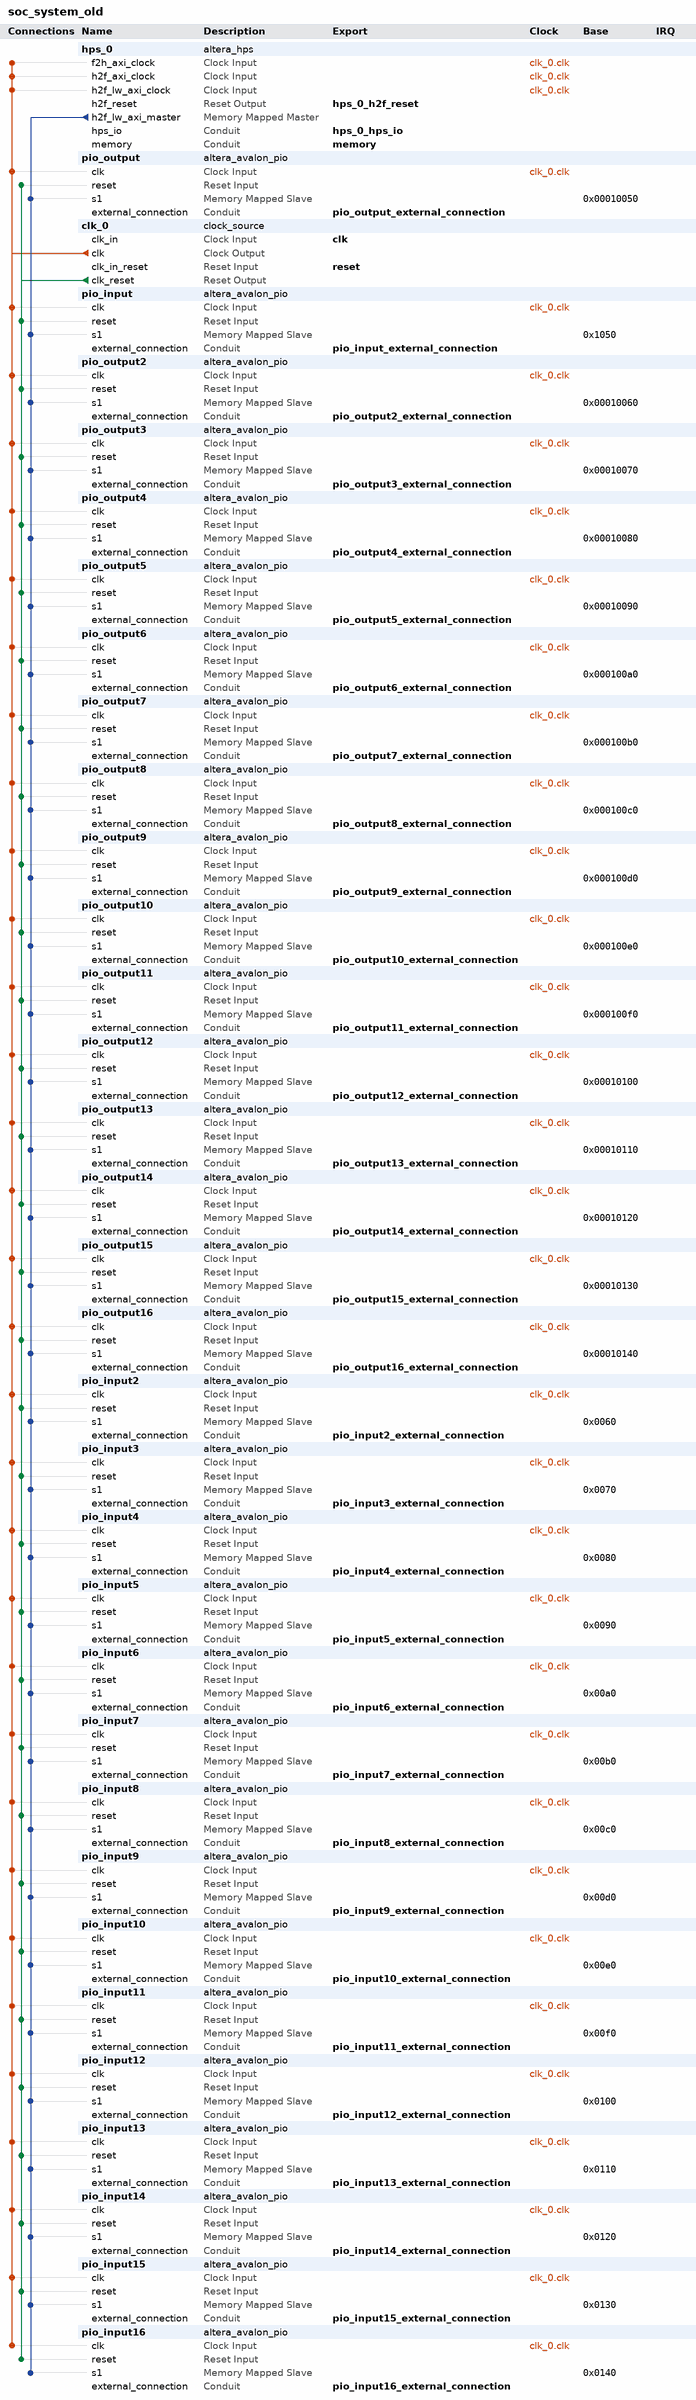
[diagram p0: system contents]
# Platform Designer (Qsys) system soc_system_old, Cyclone V 5CSEMA5F31C6
# Parameters at their usual value, and those the tool derives, are not listed.
package require -exact qsys 16.1
create_system soc_system_old
set_project_property DEVICE_FAMILY {Cyclone V}
set_project_property DEVICE 5CSEMA5F31C6

add_instance hps_0 altera_hps 16.1
set_instance_parameter_value hps_0 EMAC1_Mode RGMII
set_instance_parameter_value hps_0 EMAC1_PinMuxing {HPS I/O Set 0}
set_instance_parameter_value hps_0 F2SCLK_COLDRST_Enable false
set_instance_parameter_value hps_0 F2SCLK_DBGRST_Enable false
set_instance_parameter_value hps_0 F2SCLK_WARMRST_Enable false
set_instance_parameter_value hps_0 F2SINTERRUPT_Enable true
set_instance_parameter_value hps_0 F2S_Width 2
set_instance_parameter_value hps_0 FPGA_PERIPHERAL_OUTPUT_CLOCK_FREQ_EMAC0_GTX_CLK 100
set_instance_parameter_value hps_0 FPGA_PERIPHERAL_OUTPUT_CLOCK_FREQ_EMAC0_MD_CLK 100.0
set_instance_parameter_value hps_0 FPGA_PERIPHERAL_OUTPUT_CLOCK_FREQ_EMAC1_GTX_CLK 100
set_instance_parameter_value hps_0 FPGA_PERIPHERAL_OUTPUT_CLOCK_FREQ_EMAC1_MD_CLK 100.0
set_instance_parameter_value hps_0 HPS_PROTOCOL DDR3
set_instance_parameter_value hps_0 I2C0_Mode I2C
set_instance_parameter_value hps_0 I2C0_PinMuxing {HPS I/O Set 0}
set_instance_parameter_value hps_0 I2C1_Mode I2C
set_instance_parameter_value hps_0 I2C1_PinMuxing {HPS I/O Set 0}
set_instance_parameter_value hps_0 LWH2F_Enable true
set_instance_parameter_value hps_0 MEM_BANKADDR_WIDTH 3
set_instance_parameter_value hps_0 MEM_CLK_FREQ 400.0
set_instance_parameter_value hps_0 MEM_COL_ADDR_WIDTH 10
set_instance_parameter_value hps_0 MEM_DQ_WIDTH 32
set_instance_parameter_value hps_0 MEM_DRV_STR RZQ/7
set_instance_parameter_value hps_0 MEM_ROW_ADDR_WIDTH 15
set_instance_parameter_value hps_0 MEM_RTT_NOM RZQ/4
set_instance_parameter_value hps_0 MEM_RTT_WR RZQ/4
set_instance_parameter_value hps_0 MEM_TCL 11
set_instance_parameter_value hps_0 MEM_TFAW_NS 30.0
set_instance_parameter_value hps_0 MEM_TRAS_NS 35.0
set_instance_parameter_value hps_0 MEM_TRCD_NS 13.75
set_instance_parameter_value hps_0 MEM_TRFC_NS 260.0
set_instance_parameter_value hps_0 MEM_TRP_NS 13.75
set_instance_parameter_value hps_0 MEM_VENDOR JEDEC
set_instance_parameter_value hps_0 MEM_WTCL 8
set_instance_parameter_value hps_0 QSPI_Mode {1 SS}
set_instance_parameter_value hps_0 QSPI_PinMuxing {HPS I/O Set 0}
set_instance_parameter_value hps_0 REF_CLK_FREQ 25.0
set_instance_parameter_value hps_0 S2FCLK_USER2CLK 5
set_instance_parameter_value hps_0 S2F_Width 2
set_instance_parameter_value hps_0 SDIO_Mode {4-bit Data}
set_instance_parameter_value hps_0 SDIO_PinMuxing {HPS I/O Set 0}
set_instance_parameter_value hps_0 SPIM1_Mode {Single Slave Select}
set_instance_parameter_value hps_0 SPIM1_PinMuxing {HPS I/O Set 0}
set_instance_parameter_value hps_0 STM_Enable false
set_instance_parameter_value hps_0 TIMING_BOARD_AC_SKEW 0.03
set_instance_parameter_value hps_0 TIMING_BOARD_AC_TO_CK_SKEW 0.0
set_instance_parameter_value hps_0 TIMING_BOARD_DQ_TO_DQS_SKEW 0.0
set_instance_parameter_value hps_0 TIMING_BOARD_MAX_CK_DELAY 0.03
set_instance_parameter_value hps_0 TIMING_BOARD_MAX_DQS_DELAY 0.02
set_instance_parameter_value hps_0 TIMING_BOARD_SKEW_BETWEEN_DQS 0.08
set_instance_parameter_value hps_0 TIMING_BOARD_SKEW_CKDQS_DIMM_MAX 0.16
set_instance_parameter_value hps_0 TIMING_BOARD_SKEW_CKDQS_DIMM_MIN 0.09
set_instance_parameter_value hps_0 TIMING_BOARD_SKEW_WITHIN_DQS 0.01
set_instance_parameter_value hps_0 TIMING_TDH 65
set_instance_parameter_value hps_0 TIMING_TDQSCK 255
set_instance_parameter_value hps_0 TIMING_TDQSQ 125
set_instance_parameter_value hps_0 TIMING_TDS 30
set_instance_parameter_value hps_0 TIMING_TIH 140
set_instance_parameter_value hps_0 TIMING_TIS 180
set_instance_parameter_value hps_0 TIMING_TQSH 0.4
set_instance_parameter_value hps_0 UART0_Mode {No Flow Control}
set_instance_parameter_value hps_0 UART0_PinMuxing {HPS I/O Set 0}
set_instance_parameter_value hps_0 USB1_Mode SDR
set_instance_parameter_value hps_0 USB1_PinMuxing {HPS I/O Set 0}
set_instance_parameter_value hps_0 desired_cfg_clk_mhz 100.0
set_instance_parameter_value hps_0 desired_qspi_clk_mhz 400.0

add_instance pio_output altera_avalon_pio 16.1
set_instance_parameter_value pio_output direction Output
set_instance_parameter_value pio_output resetValue 1023
set_instance_parameter_value pio_output width 32

add_instance clk_0 clock_source 16.1
set_instance_parameter_value clk_0 clockFrequency 50000000

add_instance pio_input altera_avalon_pio 16.1
set_instance_parameter_value pio_input direction Input
set_instance_parameter_value pio_input width 32

add_instance pio_output2 altera_avalon_pio 16.1
set_instance_parameter_value pio_output2 direction Output
set_instance_parameter_value pio_output2 resetValue 1023
set_instance_parameter_value pio_output2 width 32

add_instance pio_output3 altera_avalon_pio 16.1
set_instance_parameter_value pio_output3 direction Output
set_instance_parameter_value pio_output3 resetValue 1023
set_instance_parameter_value pio_output3 width 32

add_instance pio_output4 altera_avalon_pio 16.1
set_instance_parameter_value pio_output4 direction Output
set_instance_parameter_value pio_output4 resetValue 1023
set_instance_parameter_value pio_output4 width 32

add_instance pio_output5 altera_avalon_pio 16.1
set_instance_parameter_value pio_output5 direction Output
set_instance_parameter_value pio_output5 resetValue 1023
set_instance_parameter_value pio_output5 width 32

add_instance pio_output6 altera_avalon_pio 16.1
set_instance_parameter_value pio_output6 direction Output
set_instance_parameter_value pio_output6 resetValue 1023
set_instance_parameter_value pio_output6 width 32

add_instance pio_output7 altera_avalon_pio 16.1
set_instance_parameter_value pio_output7 direction Output
set_instance_parameter_value pio_output7 resetValue 1023
set_instance_parameter_value pio_output7 width 32

add_instance pio_output8 altera_avalon_pio 16.1
set_instance_parameter_value pio_output8 direction Output
set_instance_parameter_value pio_output8 resetValue 1023
set_instance_parameter_value pio_output8 width 32

add_instance pio_output9 altera_avalon_pio 16.1
set_instance_parameter_value pio_output9 direction Output
set_instance_parameter_value pio_output9 resetValue 1023
set_instance_parameter_value pio_output9 width 32

add_instance pio_output10 altera_avalon_pio 16.1
set_instance_parameter_value pio_output10 direction Output
set_instance_parameter_value pio_output10 resetValue 1023
set_instance_parameter_value pio_output10 width 32

add_instance pio_output11 altera_avalon_pio 16.1
set_instance_parameter_value pio_output11 direction Output
set_instance_parameter_value pio_output11 resetValue 1023
set_instance_parameter_value pio_output11 width 32

add_instance pio_output12 altera_avalon_pio 16.1
set_instance_parameter_value pio_output12 direction Output
set_instance_parameter_value pio_output12 resetValue 1023
set_instance_parameter_value pio_output12 width 32

add_instance pio_output13 altera_avalon_pio 16.1
set_instance_parameter_value pio_output13 direction Output
set_instance_parameter_value pio_output13 resetValue 1023
set_instance_parameter_value pio_output13 width 32

add_instance pio_output14 altera_avalon_pio 16.1
set_instance_parameter_value pio_output14 direction Output
set_instance_parameter_value pio_output14 resetValue 1023
set_instance_parameter_value pio_output14 width 32

add_instance pio_output15 altera_avalon_pio 16.1
set_instance_parameter_value pio_output15 direction Output
set_instance_parameter_value pio_output15 resetValue 1023
set_instance_parameter_value pio_output15 width 32

add_instance pio_output16 altera_avalon_pio 16.1
set_instance_parameter_value pio_output16 direction Output
set_instance_parameter_value pio_output16 resetValue 1023
set_instance_parameter_value pio_output16 width 32

add_instance pio_input2 altera_avalon_pio 16.1
set_instance_parameter_value pio_input2 direction Input
set_instance_parameter_value pio_input2 width 32

add_instance pio_input3 altera_avalon_pio 16.1
set_instance_parameter_value pio_input3 direction Input
set_instance_parameter_value pio_input3 width 32

add_instance pio_input4 altera_avalon_pio 16.1
set_instance_parameter_value pio_input4 direction Input
set_instance_parameter_value pio_input4 width 32

add_instance pio_input5 altera_avalon_pio 16.1
set_instance_parameter_value pio_input5 direction Input
set_instance_parameter_value pio_input5 width 32

add_instance pio_input6 altera_avalon_pio 16.1
set_instance_parameter_value pio_input6 direction Input
set_instance_parameter_value pio_input6 width 32

add_instance pio_input7 altera_avalon_pio 16.1
set_instance_parameter_value pio_input7 direction Input
set_instance_parameter_value pio_input7 width 32

add_instance pio_input8 altera_avalon_pio 16.1
set_instance_parameter_value pio_input8 direction Input
set_instance_parameter_value pio_input8 width 32

add_instance pio_input9 altera_avalon_pio 16.1
set_instance_parameter_value pio_input9 direction Input
set_instance_parameter_value pio_input9 width 32

add_instance pio_input10 altera_avalon_pio 16.1
set_instance_parameter_value pio_input10 direction Input
set_instance_parameter_value pio_input10 width 32

add_instance pio_input11 altera_avalon_pio 16.1
set_instance_parameter_value pio_input11 direction Input
set_instance_parameter_value pio_input11 width 32

add_instance pio_input12 altera_avalon_pio 16.1
set_instance_parameter_value pio_input12 direction Input
set_instance_parameter_value pio_input12 width 32

add_instance pio_input13 altera_avalon_pio 16.1
set_instance_parameter_value pio_input13 direction Input
set_instance_parameter_value pio_input13 width 32

add_instance pio_input14 altera_avalon_pio 16.1
set_instance_parameter_value pio_input14 direction Input
set_instance_parameter_value pio_input14 width 32

add_instance pio_input15 altera_avalon_pio 16.1
set_instance_parameter_value pio_input15 direction Input
set_instance_parameter_value pio_input15 width 32

add_instance pio_input16 altera_avalon_pio 16.1
set_instance_parameter_value pio_input16 direction Input
set_instance_parameter_value pio_input16 width 32

# connections
add_connection clk_0.clk hps_0.f2h_axi_clock clock
add_connection clk_0.clk hps_0.h2f_axi_clock clock
add_connection clk_0.clk hps_0.h2f_lw_axi_clock clock
add_connection clk_0.clk pio_input2.clk clock
add_connection clk_0.clk pio_input3.clk clock
add_connection clk_0.clk pio_input4.clk clock
add_connection clk_0.clk pio_input5.clk clock
add_connection clk_0.clk pio_input6.clk clock
add_connection clk_0.clk pio_input7.clk clock
add_connection clk_0.clk pio_input8.clk clock
add_connection clk_0.clk pio_input9.clk clock
add_connection clk_0.clk pio_input10.clk clock
add_connection clk_0.clk pio_input11.clk clock
add_connection clk_0.clk pio_input12.clk clock
add_connection clk_0.clk pio_input13.clk clock
add_connection clk_0.clk pio_input14.clk clock
add_connection clk_0.clk pio_input15.clk clock
add_connection clk_0.clk pio_input16.clk clock
add_connection clk_0.clk pio_input.clk clock
add_connection clk_0.clk pio_output2.clk clock
add_connection clk_0.clk pio_output3.clk clock
add_connection clk_0.clk pio_output4.clk clock
add_connection clk_0.clk pio_output5.clk clock
add_connection clk_0.clk pio_output6.clk clock
add_connection clk_0.clk pio_output7.clk clock
add_connection clk_0.clk pio_output8.clk clock
add_connection clk_0.clk pio_output9.clk clock
add_connection clk_0.clk pio_output10.clk clock
add_connection clk_0.clk pio_output11.clk clock
add_connection clk_0.clk pio_output12.clk clock
add_connection clk_0.clk pio_output13.clk clock
add_connection clk_0.clk pio_output14.clk clock
add_connection clk_0.clk pio_output15.clk clock
add_connection clk_0.clk pio_output16.clk clock
add_connection clk_0.clk pio_output.clk clock
add_connection clk_0.clk_reset pio_input2.reset reset
add_connection clk_0.clk_reset pio_input3.reset reset
add_connection clk_0.clk_reset pio_input4.reset reset
add_connection clk_0.clk_reset pio_input5.reset reset
add_connection clk_0.clk_reset pio_input6.reset reset
add_connection clk_0.clk_reset pio_input7.reset reset
add_connection clk_0.clk_reset pio_input8.reset reset
add_connection clk_0.clk_reset pio_input9.reset reset
add_connection clk_0.clk_reset pio_input10.reset reset
add_connection clk_0.clk_reset pio_input11.reset reset
add_connection clk_0.clk_reset pio_input12.reset reset
add_connection clk_0.clk_reset pio_input13.reset reset
add_connection clk_0.clk_reset pio_input14.reset reset
add_connection clk_0.clk_reset pio_input15.reset reset
add_connection clk_0.clk_reset pio_input16.reset reset
add_connection clk_0.clk_reset pio_input.reset reset
add_connection clk_0.clk_reset pio_output2.reset reset
add_connection clk_0.clk_reset pio_output3.reset reset
add_connection clk_0.clk_reset pio_output4.reset reset
add_connection clk_0.clk_reset pio_output5.reset reset
add_connection clk_0.clk_reset pio_output6.reset reset
add_connection clk_0.clk_reset pio_output7.reset reset
add_connection clk_0.clk_reset pio_output8.reset reset
add_connection clk_0.clk_reset pio_output9.reset reset
add_connection clk_0.clk_reset pio_output10.reset reset
add_connection clk_0.clk_reset pio_output11.reset reset
add_connection clk_0.clk_reset pio_output12.reset reset
add_connection clk_0.clk_reset pio_output13.reset reset
add_connection clk_0.clk_reset pio_output14.reset reset
add_connection clk_0.clk_reset pio_output15.reset reset
add_connection clk_0.clk_reset pio_output16.reset reset
add_connection clk_0.clk_reset pio_output.reset reset
add_connection hps_0.h2f_lw_axi_master pio_input2.s1 avalon
set_connection_parameter_value hps_0.h2f_lw_axi_master/pio_input2.s1 baseAddress 0x0060
add_connection hps_0.h2f_lw_axi_master pio_input3.s1 avalon
set_connection_parameter_value hps_0.h2f_lw_axi_master/pio_input3.s1 baseAddress 0x0070
add_connection hps_0.h2f_lw_axi_master pio_input4.s1 avalon
set_connection_parameter_value hps_0.h2f_lw_axi_master/pio_input4.s1 baseAddress 0x0080
add_connection hps_0.h2f_lw_axi_master pio_input5.s1 avalon
set_connection_parameter_value hps_0.h2f_lw_axi_master/pio_input5.s1 baseAddress 0x0090
add_connection hps_0.h2f_lw_axi_master pio_input6.s1 avalon
set_connection_parameter_value hps_0.h2f_lw_axi_master/pio_input6.s1 baseAddress 0x00a0
add_connection hps_0.h2f_lw_axi_master pio_input7.s1 avalon
set_connection_parameter_value hps_0.h2f_lw_axi_master/pio_input7.s1 baseAddress 0x00b0
add_connection hps_0.h2f_lw_axi_master pio_input8.s1 avalon
set_connection_parameter_value hps_0.h2f_lw_axi_master/pio_input8.s1 baseAddress 0x00c0
add_connection hps_0.h2f_lw_axi_master pio_input9.s1 avalon
set_connection_parameter_value hps_0.h2f_lw_axi_master/pio_input9.s1 baseAddress 0x00d0
add_connection hps_0.h2f_lw_axi_master pio_input10.s1 avalon
set_connection_parameter_value hps_0.h2f_lw_axi_master/pio_input10.s1 baseAddress 0x00e0
add_connection hps_0.h2f_lw_axi_master pio_input11.s1 avalon
set_connection_parameter_value hps_0.h2f_lw_axi_master/pio_input11.s1 baseAddress 0x00f0
add_connection hps_0.h2f_lw_axi_master pio_input12.s1 avalon
set_connection_parameter_value hps_0.h2f_lw_axi_master/pio_input12.s1 baseAddress 0x0100
add_connection hps_0.h2f_lw_axi_master pio_input13.s1 avalon
set_connection_parameter_value hps_0.h2f_lw_axi_master/pio_input13.s1 baseAddress 0x0110
add_connection hps_0.h2f_lw_axi_master pio_input14.s1 avalon
set_connection_parameter_value hps_0.h2f_lw_axi_master/pio_input14.s1 baseAddress 0x0120
add_connection hps_0.h2f_lw_axi_master pio_input15.s1 avalon
set_connection_parameter_value hps_0.h2f_lw_axi_master/pio_input15.s1 baseAddress 0x0130
add_connection hps_0.h2f_lw_axi_master pio_input16.s1 avalon
set_connection_parameter_value hps_0.h2f_lw_axi_master/pio_input16.s1 baseAddress 0x0140
add_connection hps_0.h2f_lw_axi_master pio_input.s1 avalon
set_connection_parameter_value hps_0.h2f_lw_axi_master/pio_input.s1 baseAddress 0x1050
add_connection hps_0.h2f_lw_axi_master pio_output2.s1 avalon
set_connection_parameter_value hps_0.h2f_lw_axi_master/pio_output2.s1 baseAddress 0x00010060
add_connection hps_0.h2f_lw_axi_master pio_output3.s1 avalon
set_connection_parameter_value hps_0.h2f_lw_axi_master/pio_output3.s1 baseAddress 0x00010070
add_connection hps_0.h2f_lw_axi_master pio_output4.s1 avalon
set_connection_parameter_value hps_0.h2f_lw_axi_master/pio_output4.s1 baseAddress 0x00010080
add_connection hps_0.h2f_lw_axi_master pio_output5.s1 avalon
set_connection_parameter_value hps_0.h2f_lw_axi_master/pio_output5.s1 baseAddress 0x00010090
add_connection hps_0.h2f_lw_axi_master pio_output6.s1 avalon
set_connection_parameter_value hps_0.h2f_lw_axi_master/pio_output6.s1 baseAddress 0x000100a0
add_connection hps_0.h2f_lw_axi_master pio_output7.s1 avalon
set_connection_parameter_value hps_0.h2f_lw_axi_master/pio_output7.s1 baseAddress 0x000100b0
add_connection hps_0.h2f_lw_axi_master pio_output8.s1 avalon
set_connection_parameter_value hps_0.h2f_lw_axi_master/pio_output8.s1 baseAddress 0x000100c0
add_connection hps_0.h2f_lw_axi_master pio_output9.s1 avalon
set_connection_parameter_value hps_0.h2f_lw_axi_master/pio_output9.s1 baseAddress 0x000100d0
add_connection hps_0.h2f_lw_axi_master pio_output10.s1 avalon
set_connection_parameter_value hps_0.h2f_lw_axi_master/pio_output10.s1 baseAddress 0x000100e0
add_connection hps_0.h2f_lw_axi_master pio_output11.s1 avalon
set_connection_parameter_value hps_0.h2f_lw_axi_master/pio_output11.s1 baseAddress 0x000100f0
add_connection hps_0.h2f_lw_axi_master pio_output12.s1 avalon
set_connection_parameter_value hps_0.h2f_lw_axi_master/pio_output12.s1 baseAddress 0x00010100
add_connection hps_0.h2f_lw_axi_master pio_output13.s1 avalon
set_connection_parameter_value hps_0.h2f_lw_axi_master/pio_output13.s1 baseAddress 0x00010110
add_connection hps_0.h2f_lw_axi_master pio_output14.s1 avalon
set_connection_parameter_value hps_0.h2f_lw_axi_master/pio_output14.s1 baseAddress 0x00010120
add_connection hps_0.h2f_lw_axi_master pio_output15.s1 avalon
set_connection_parameter_value hps_0.h2f_lw_axi_master/pio_output15.s1 baseAddress 0x00010130
add_connection hps_0.h2f_lw_axi_master pio_output16.s1 avalon
set_connection_parameter_value hps_0.h2f_lw_axi_master/pio_output16.s1 baseAddress 0x00010140
add_connection hps_0.h2f_lw_axi_master pio_output.s1 avalon
set_connection_parameter_value hps_0.h2f_lw_axi_master/pio_output.s1 baseAddress 0x00010050

# exported interfaces
add_interface clk clock sink
set_interface_property clk EXPORT_OF clk_0.clk_in
add_interface hps_0_h2f_reset reset source
set_interface_property hps_0_h2f_reset EXPORT_OF hps_0.h2f_reset
add_interface hps_0_hps_io conduit end
set_interface_property hps_0_hps_io EXPORT_OF hps_0.hps_io
add_interface memory conduit end
set_interface_property memory EXPORT_OF hps_0.memory
add_interface pio_input10_external_connection conduit end
set_interface_property pio_input10_external_connection EXPORT_OF pio_input10.external_connection
add_interface pio_input11_external_connection conduit end
set_interface_property pio_input11_external_connection EXPORT_OF pio_input11.external_connection
add_interface pio_input12_external_connection conduit end
set_interface_property pio_input12_external_connection EXPORT_OF pio_input12.external_connection
add_interface pio_input13_external_connection conduit end
set_interface_property pio_input13_external_connection EXPORT_OF pio_input13.external_connection
add_interface pio_input14_external_connection conduit end
set_interface_property pio_input14_external_connection EXPORT_OF pio_input14.external_connection
add_interface pio_input15_external_connection conduit end
set_interface_property pio_input15_external_connection EXPORT_OF pio_input15.external_connection
add_interface pio_input16_external_connection conduit end
set_interface_property pio_input16_external_connection EXPORT_OF pio_input16.external_connection
add_interface pio_input2_external_connection conduit end
set_interface_property pio_input2_external_connection EXPORT_OF pio_input2.external_connection
add_interface pio_input3_external_connection conduit end
set_interface_property pio_input3_external_connection EXPORT_OF pio_input3.external_connection
add_interface pio_input4_external_connection conduit end
set_interface_property pio_input4_external_connection EXPORT_OF pio_input4.external_connection
add_interface pio_input5_external_connection conduit end
set_interface_property pio_input5_external_connection EXPORT_OF pio_input5.external_connection
add_interface pio_input6_external_connection conduit end
set_interface_property pio_input6_external_connection EXPORT_OF pio_input6.external_connection
add_interface pio_input7_external_connection conduit end
set_interface_property pio_input7_external_connection EXPORT_OF pio_input7.external_connection
add_interface pio_input8_external_connection conduit end
set_interface_property pio_input8_external_connection EXPORT_OF pio_input8.external_connection
add_interface pio_input9_external_connection conduit end
set_interface_property pio_input9_external_connection EXPORT_OF pio_input9.external_connection
add_interface pio_input_external_connection conduit end
set_interface_property pio_input_external_connection EXPORT_OF pio_input.external_connection
add_interface pio_output10_external_connection conduit end
set_interface_property pio_output10_external_connection EXPORT_OF pio_output10.external_connection
add_interface pio_output11_external_connection conduit end
set_interface_property pio_output11_external_connection EXPORT_OF pio_output11.external_connection
add_interface pio_output12_external_connection conduit end
set_interface_property pio_output12_external_connection EXPORT_OF pio_output12.external_connection
add_interface pio_output13_external_connection conduit end
set_interface_property pio_output13_external_connection EXPORT_OF pio_output13.external_connection
add_interface pio_output14_external_connection conduit end
set_interface_property pio_output14_external_connection EXPORT_OF pio_output14.external_connection
add_interface pio_output15_external_connection conduit end
set_interface_property pio_output15_external_connection EXPORT_OF pio_output15.external_connection
add_interface pio_output16_external_connection conduit end
set_interface_property pio_output16_external_connection EXPORT_OF pio_output16.external_connection
add_interface pio_output2_external_connection conduit end
set_interface_property pio_output2_external_connection EXPORT_OF pio_output2.external_connection
add_interface pio_output3_external_connection conduit end
set_interface_property pio_output3_external_connection EXPORT_OF pio_output3.external_connection
add_interface pio_output4_external_connection conduit end
set_interface_property pio_output4_external_connection EXPORT_OF pio_output4.external_connection
add_interface pio_output5_external_connection conduit end
set_interface_property pio_output5_external_connection EXPORT_OF pio_output5.external_connection
add_interface pio_output6_external_connection conduit end
set_interface_property pio_output6_external_connection EXPORT_OF pio_output6.external_connection
add_interface pio_output7_external_connection conduit end
set_interface_property pio_output7_external_connection EXPORT_OF pio_output7.external_connection
add_interface pio_output8_external_connection conduit end
set_interface_property pio_output8_external_connection EXPORT_OF pio_output8.external_connection
add_interface pio_output9_external_connection conduit end
set_interface_property pio_output9_external_connection EXPORT_OF pio_output9.external_connection
add_interface pio_output_external_connection conduit end
set_interface_property pio_output_external_connection EXPORT_OF pio_output.external_connection
add_interface reset reset sink
set_interface_property reset EXPORT_OF clk_0.clk_in_reset

set_interconnect_requirement {$system} qsys_mm.clockCrossingAdapter HANDSHAKE
set_interconnect_requirement {$system} qsys_mm.maxAdditionalLatency 1

save_system soc_system_old.qsys
